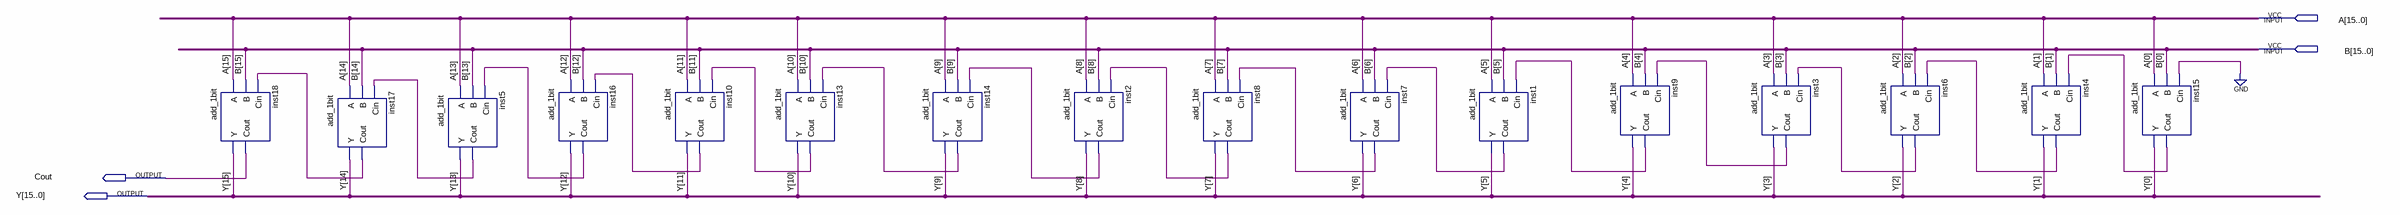
[diagram p0: schematic sheet]
// Quartus schematic add_16bit.bdf as structural Verilog: 16 symbols, 4 pins
module add_16bit (
  input  [15:0] A,
  input  [15:0] B,
  output Cout,
  output [15:0] Y
);

  wire inst1_cout, inst2_cout, inst3_cout, inst4_cout, inst5_cout, inst6_cout, inst7_cout, inst8_cout,
       inst9_cout, inst10_cout, inst13_cout, inst14_cout, inst15_cout, inst16_cout, inst17_cout;

  add_1bit inst18 (.A(A[15]), .B(B[15]), .Cin(inst17_cout), .Y(Y[15]), .Cout(Cout));
  add_1bit inst17 (.A(A[14]), .B(B[14]), .Cin(inst5_cout), .Y(Y[14]), .Cout(inst17_cout));
  add_1bit inst5 (.A(A[13]), .B(B[13]), .Cin(inst16_cout), .Y(Y[13]), .Cout(inst5_cout));
  add_1bit inst16 (.A(A[12]), .B(B[12]), .Cin(inst10_cout), .Y(Y[12]), .Cout(inst16_cout));
  add_1bit inst10 (.A(A[11]), .B(B[11]), .Cin(inst13_cout), .Y(Y[11]), .Cout(inst10_cout));
  add_1bit inst13 (.A(A[10]), .B(B[10]), .Cin(inst14_cout), .Y(Y[10]), .Cout(inst13_cout));
  add_1bit inst14 (.A(A[9]), .B(B[9]), .Cin(inst2_cout), .Y(Y[9]), .Cout(inst14_cout));
  add_1bit inst2 (.A(A[8]), .B(B[8]), .Cin(inst8_cout), .Y(Y[8]), .Cout(inst2_cout));
  add_1bit inst8 (.A(A[7]), .B(B[7]), .Cin(inst7_cout), .Y(Y[7]), .Cout(inst8_cout));
  add_1bit inst7 (.A(A[6]), .B(B[6]), .Cin(inst1_cout), .Y(Y[6]), .Cout(inst7_cout));
  add_1bit inst1 (.A(A[5]), .B(B[5]), .Cin(inst9_cout), .Y(Y[5]), .Cout(inst1_cout));
  add_1bit inst9 (.A(A[4]), .B(B[4]), .Cin(inst3_cout), .Y(Y[4]), .Cout(inst9_cout));
  add_1bit inst3 (.A(A[3]), .B(B[3]), .Cin(inst6_cout), .Y(Y[3]), .Cout(inst3_cout));
  add_1bit inst6 (.A(A[2]), .B(B[2]), .Cin(inst4_cout), .Y(Y[2]), .Cout(inst6_cout));
  add_1bit inst4 (.A(A[1]), .B(B[1]), .Cin(inst15_cout), .Y(Y[1]), .Cout(inst4_cout));
  add_1bit inst15 (.A(A[0]), .B(B[0]), .Cin(1'b0), .Y(Y[0]), .Cout(inst15_cout));
endmodule
